# Altium schematic sheet Sheet1.SchDoc
size A4
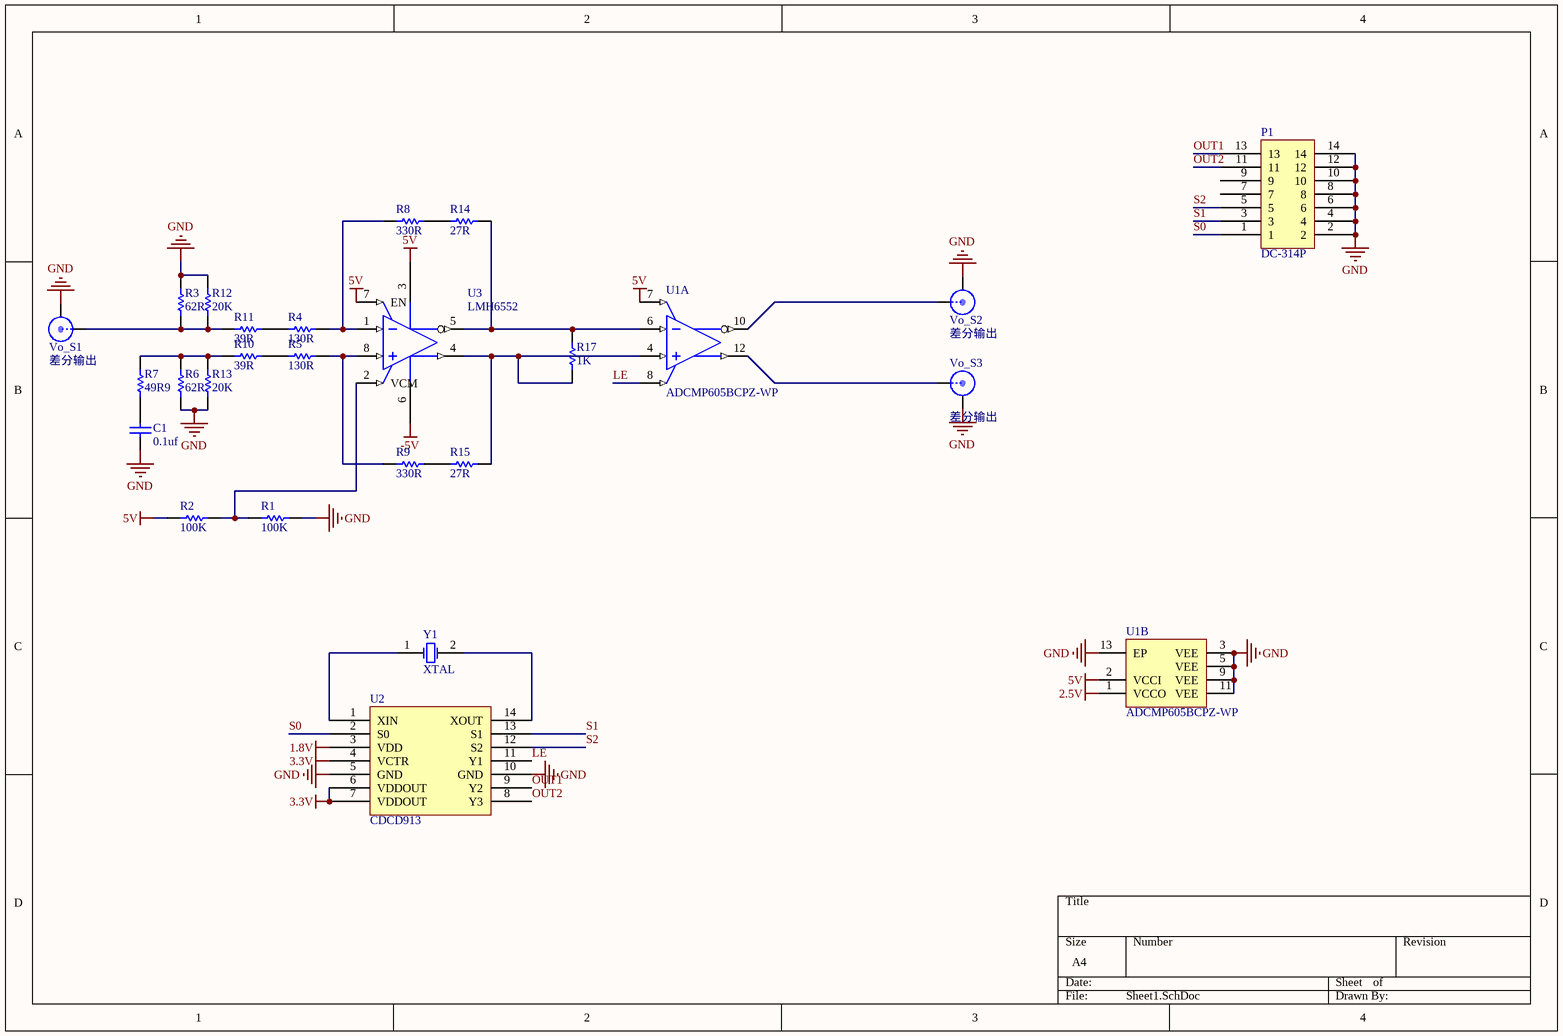
[diagram p0: Sheet1.SchDoc]

## Parts
C1  0.1uf  [0805]
P1  DC-314P  [DC3-14P]
R1  100K  [0805]
R2  100K  [0805]
R3  62R  [0805]
R4  130R  [0805]
R5  130R  [0805]
R6  62R  [0805]
R7  49R9  [0805]
R8  330R  [0805]
R9  330R  [0805]
R10  39R  [0805]
R11  39R  [0805]
R12  20K  [0805]
R13  20K  [0805]
R14  27R  [0805]
R15  27R  [0805]
R17  1K  [0805]
U1  ADCMP605BCPZ-WP  [ADI-CP-12-1_N]  (parts A,B of 2)
U2  CDCD913  [RU-14_L]
U3  LMH6552  [TI-D8_L]
Vo_S1  差分输出  [SMA-LYING]
Vo_S2  差分输出  [SMA-LYING]
Vo_S3  差分输出  [SMA-LYING]
Y1  XTAL  [HC-49S]

## Nets
1.8V: U2.3(VDD)
2.5V: U1.1(VCCO)
3.3V: U2.4(VCTR) U2.6(VDDOUT) U2.7(VDDOUT)
5V: R2.1 U1.2(VCCI) U1.7(SDN) U3.3(VCC) U3.7(EN)
-5V: U3.6(VDD)
GND: C1.1 P1.2 P1.4 P1.6 P1.8 P1.10 P1.12 P1.14 R1.2 R3.2 R6.2 R12.2 R13.1 U1.3(VEE) U1.5(VEE) U1.9(VEE) U1.11(VEE) U1.13(EP) U2.5(GND) U2.10(GND) Vo_S1.1 Vo_S2.1 Vo_S3.1
LE: U1.8(LE/HYS) U2.11(Y1)
OUT1: P1.13 U2.9(Y2)
OUT2: P1.11 U2.8(Y3)
S0: P1.1 U2.2(S0)
S1: P1.3 U2.13(S1)
S2: P1.5 U2.12(S2)
NetC1_2: C1.2 R7.2
NetR1_1: R1.1 R2.2 U3.2(VCM)
NetR3_1: R3.1 R11.1 R12.1 Vo_S1.0
NetR4_1: R4.1 R8.1 U3.1(VN)
NetR4_2: R4.2 R11.2
NetR5_1: R5.1 R9.1 U3.8(VP)
NetR5_2: R5.2 R10.2
NetR6_1: R6.1 R7.1 R10.1 R13.2
NetR8_2: R8.2 R14.2
NetR9_2: R9.2 R15.2
NetR14_1: R14.1 R17.2 U1.6(VN) U3.5(~{Q})
NetR15_1: R15.1 R17.1 U1.4(VP) U3.4(Q)
NetU1_10: U1.10(~{Q}) Vo_S2.0
NetU1_12: U1.12(Q) Vo_S3.0
NetU2_1: U2.1(XIN) Y1.1(OSC1)
NetU2_14: U2.14(XOUT) Y1.2(OSC2)

Not connected (* = marked no-connect by the designer): P1 7 9

## Library data of the parts
C1 = Cap
P1 = DC3-14P
R1-R15 R17 = Res
U1 = ADCMP605BCPZ-WP: Rail-to-Rail, Very Fast, Single-Supply LVDS Comparator, 2.5 to 5.5 V, 1.5 ns Delay, Industrial, 12-pin QFN (CP-12-1), Tray; Manufacturer: Analog Devices; Input Range (V): -0.2 to VCC+0.2; Total Power (mW): 42mW; DatasheetVersion: Rev. A; PackageReference: CP-12-1; PackageDescription: 12-Pin Lead Frame Chip Scale Package, Body 3 x 3 mm, Pitch 0.5 mm; Supplier 1: Digi-Key; Supplier Part Number 1: ADCMP605BCPZ-WP-ND; Supplier 2: Farnell; Supplier Part Number 2: 2376811; Supplier 3: Mouser; Supplier Part Number 3: 584-ADCMP605BCPZ-WP; Packing: Tray; Voltage Supply (V): 2.5 to 5.5; Mounting Technology: Surface Mount; Code_JEDEC: MO-220-VEED-1; PartNumber: ADCMP605BCPZ-WP; ComponentLink1Description: Manufacturer URL; ComponentLink1URL: http://www.analog.com/en/index.html; ComponentLink2Description: Datasheet; ComponentLink2URL: http://www.analog.com/static/imported-files/data_sheets/ADCMP604_605.pdf; ComponentLink3Description: Package Specification; ComponentLink3URL: http://www.analog.com/static/imported-files/packages/CP_12_1.pdf; ComponentLink4Description: URL Link1; ComponentLink4URL: Product URL:http://www.analog.com/en/special-linear-functions/comparators/adcmp605/products/product.html
Vo_S1-Vo_S3 = SMA
Y1 = XTAL: Crystal Oscillator; Published: 8-Jun-2000; LatestRevisionDate: 17-Jul-2002; LatestRevisionNote: Re-released for DXP Platform.; PackageReference: R38; Publisher: Altium Limited; PackageDescription: Crystal, Thru-Hole; 2 Leads; Body 3.1 x 8.2 mm (Dia.xH)